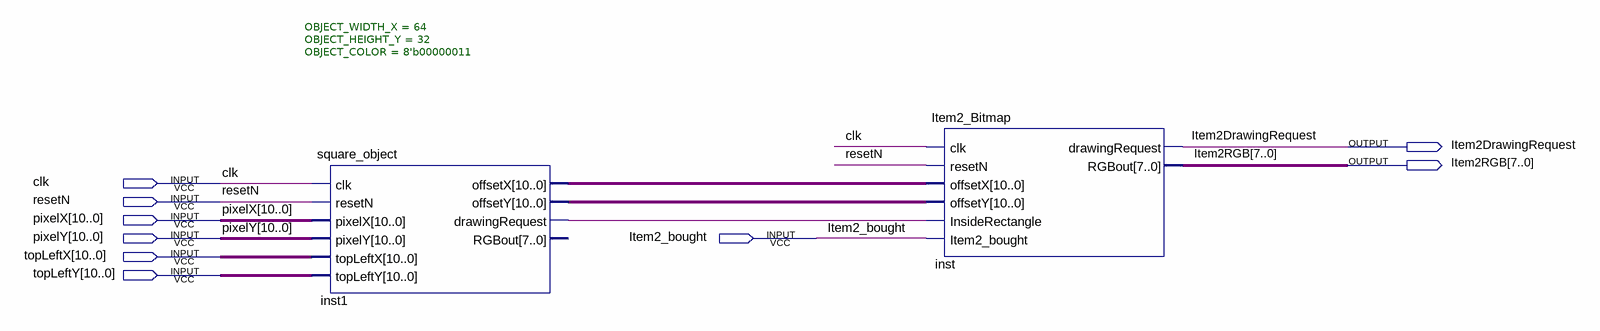
[diagram p0: schematic sheet]
// Quartus schematic Item2_Display.bdf as structural Verilog: 2 symbols, 9 pins
module Item2_Display (
  input  clk,
  input  resetN,
  input  [10:0] pixelX,
  input  [10:0] pixelY,
  input  Item2_bought,
  input  [10:0] topLeftX,
  input  [10:0] topLeftY,
  output Item2DrawingRequest,
  output [7:0] Item2RGB
);

  wire inst1_drawingrequest;
  wire [10:0] inst1_offsetx, inst1_offsety;

  square_object #(.OBJECT_WIDTH_X(64), .OBJECT_HEIGHT_Y(32), .OBJECT_COLOR(8'b00000011)) inst1 (
    .clk(clk), .resetN(resetN), .pixelX(pixelX), .pixelY(pixelY), .topLeftX(topLeftX), .topLeftY(topLeftY),
    .offsetX(inst1_offsetx), .offsetY(inst1_offsety), .drawingRequest(inst1_drawingrequest));  // open: RGBout
  Item2_Bitmap inst (
    .clk(clk), .resetN(resetN), .offsetX(inst1_offsetx), .offsetY(inst1_offsety),
    .InsideRectangle(inst1_drawingrequest), .Item2_bought(Item2_bought),
    .drawingRequest(Item2DrawingRequest), .RGBout(Item2RGB));
endmodule
